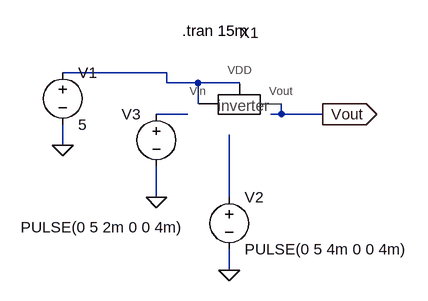
[diagram p0: schematic Simulating_Inverter.asc]
Simulating_Inverter.asc, the LTspice schematic file:
Version 4
SHEET 1 880 680
WIRE 80 144 -80 144
WIRE 80 160 80 144
WIRE 128 160 80 160
WIRE 192 160 128 160
WIRE 128 192 128 160
WIRE 112 208 64 208
WIRE 256 208 256 192
WIRE 256 208 240 208
WIRE 320 208 256 208
WIRE -80 256 -80 224
WIRE 64 336 64 288
WIRE 176 336 176 240
WIRE 176 448 176 416
FLAG -80 256 0
FLAG 64 336 0
FLAG 176 448 0
FLAG 320 208 Vout
IOPIN 320 208 Out
SYMBOL voltage -80 128 R0
WINDOW 123 0 0 Left 2
WINDOW 39 0 0 Left 2
SYMATTR InstName V1
SYMATTR Value 5
SYMBOL voltage 176 320 R0
WINDOW 123 0 0 Left 2
WINDOW 39 0 0 Left 2
SYMATTR InstName V2
SYMATTR Value PULSE(0 5 4m 0 0 4m)
SYMBOL voltage 64 192 M0
WINDOW 3 -41 190 Left 2
WINDOW 123 0 0 Left 2
WINDOW 39 0 0 Left 2
SYMATTR Value PULSE(0 5 2m 0 0 4m)
SYMATTR InstName V3
SYMBOL Inverter 224 208 R0
SYMATTR InstName X1
TEXT 104 80 Left 2 !.tran 15m

The netlist it stands for:
* Simulating_Inverter.asc
V1 N001 0 5
V2 N003 0 PULSE(0 5 4m 0 0 4m)
V3 N002 0 PULSE(0 5 2m 0 0 4m)
XX1 N001 N001 Vout Inverter  ; pins Vin VDD Vout
.tran 15m
.backanno
.end